# EAGLE design 5vreg (EAGLE 5.11)
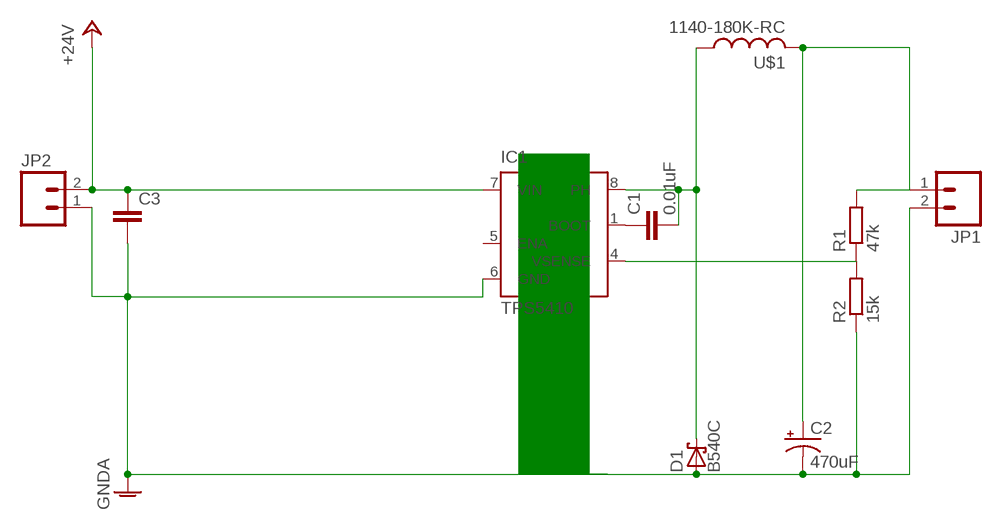
[diagram p0: schematic, sheet 1]

## Parts
C1  0.01uF  C-EU025-030X050  [C025-030X050]
C2  470uF  CAP_POLSMD  [VISHAY_C]
C3  C-EUC1210K  [C1210K]
D1  B540C  MBRS320T3  [SMC]
IC1  TPS5410  [D_R-PDSO-G08]
JP1  M02  [1X02_LONGPADS]
JP2  M02  [1X02_LONGPADS]
R1  47k  R-EU_0309/12  [0309/12]
R2  15k  R-EU_0309/12  [0309/12]
U$1  1140-180K-RC  [1140-180K-RC]

## Nets
+24V: C3.1 IC1.7(VIN) JP2.2
GNDA: C2.- C3.2 D1.A IC1.6(GND) JP1.2 JP2.1 R2.1
N$3: C1.1 IC1.1(BOOT)
PH: C1.2 D1.C IC1.8(PH) U$1.1
VOUT: C2.+ JP1.1 R1.2 U$1.2
VSENSE: IC1.4(VSENSE) R1.1 R2.2
Unconnected: IC1.5(ENA)

## Library data of the parts
C1 C3 = rcl:C-EU: CAPACITOR, European symbol
C2 = SparkFun:CAP_POL: Capacitor Polarized These are standard SMD and PTH capacitors. Normally 10uF, 47uF, and 100uF in electrolytic and tantalum varieties. Always verify the external diameter of the through hole cap, it varies with capacity, voltage, and manufacturer. The EIA devices should be standard.
D1 = diode:MBRS3*0T3: SCHOTTKY BARRIER RECTIFIER 3.0 AMPERES 20, 30, 40 VOLT Source: MBRS340T3-D.pdf
IC1 = texas:TPS5410: 1-A, WIDE INPUT RANGE, STEP-DOWN SWIFT? CONVERTER Source: U7 Texas TPS5410 Step Down Converter.pdf; MPN: TPS5410DR; OC_FARNELL: 1329596; OC_NEWARK: 18M3223
JP1 JP2 = SparkFun:M02: Header 2 Standard 2-pin 0.1" header. Use with straight break away headers (SKU : PRT-00116), right angle break away headers (PRT-00553), swiss pins (PRT-00743), machine pins (PRT-00117), and female headers (PRT-00115). Molex polarized connector foot print use with SKU : PRT-08233 with associated crimp pins and housings.
R1 R2 = rcl:R-EU_: RESISTOR, European symbol
U$1 = mine:1140-180K-RC

## Board
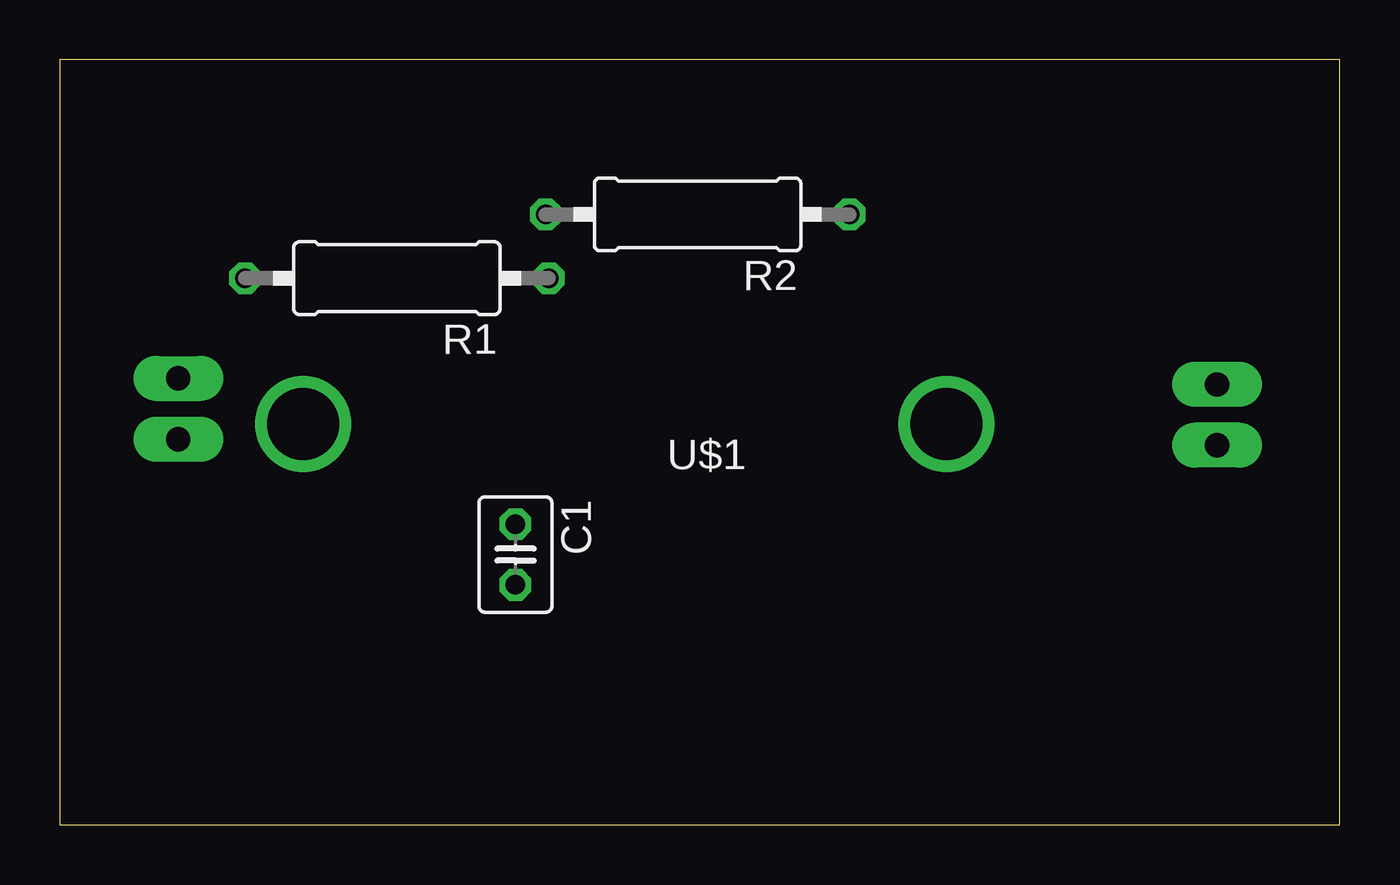
[diagram p1: board, top side]
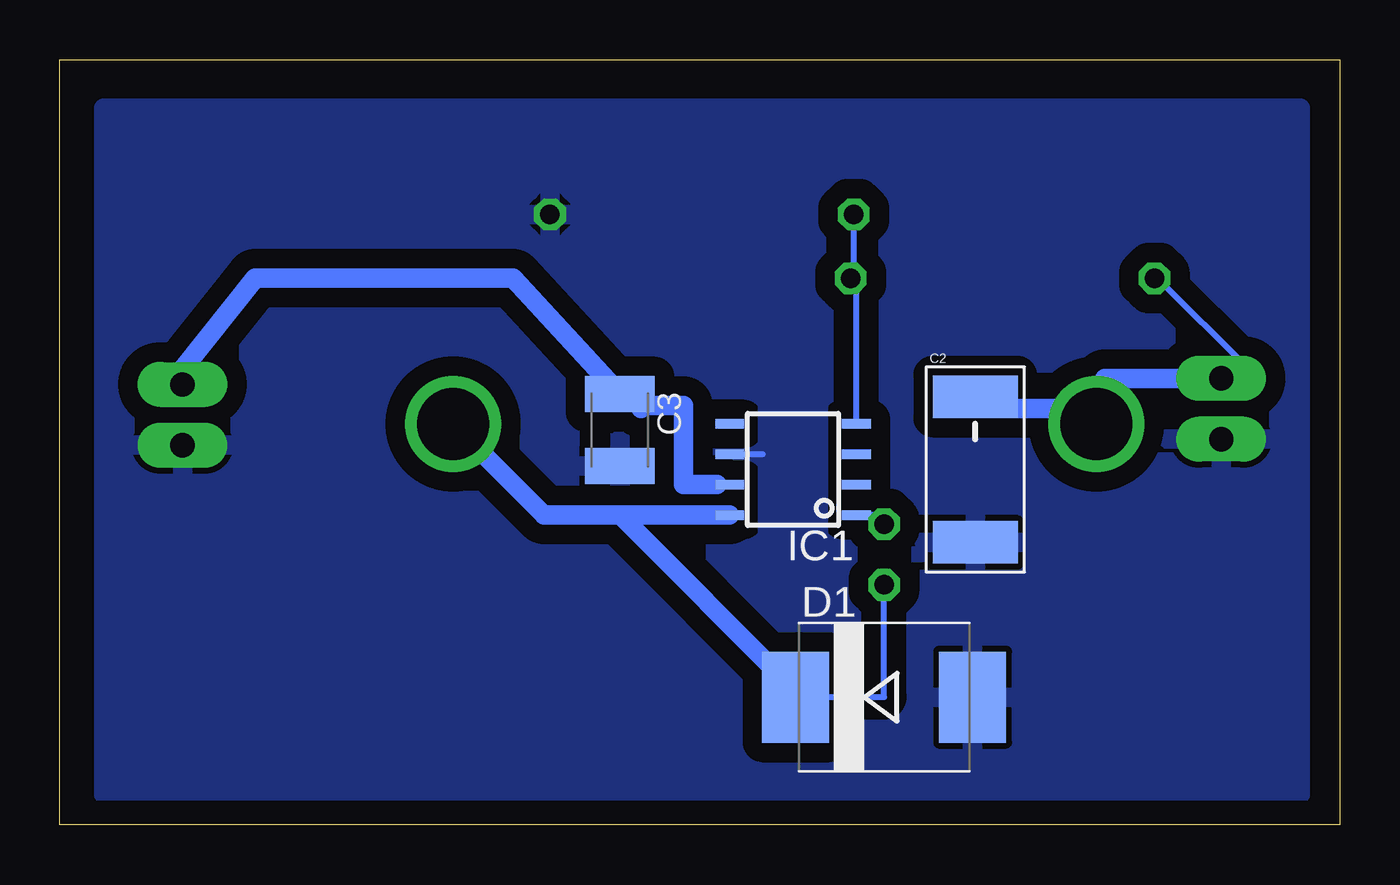
[diagram p2: board, bottom side, seen from below]

Size 53.52 x 31.99 mm. Coordinates in mm from the lower left corner, seen from the top.
Outline: 0,0 53.52,0 53.52,31.99 0,31.99 0,0
Copper layers (1*16): Top 0.035mm / dielectric 1.5mm / Bottom 0.035mm
Design rules "default": minimum track width 10mil, minimum drill 24mil, track to track 8mil, track to pad 8mil, pad to pad 8mil, via to via 8mil, smd to smd 8mil, copper to edge 40mil, drill to drill 8mil, minimum pad ring 10mil, minimum via ring 8mil, stop-mask expansion 4mil, vias tented up to drill 0mil, thermal gap 10mil

### Footprints (pad centres in the part's own frame; a part is rotated, then mirrored left to right if it is on the bottom)
C025-030X050 = drill 0.813 octagon: 1 -1.27,0; 2 1.27,0
VISHAY_C = smd 3.556 x 1.778: + 0,3.048; - 0,-3.048
C1210K = smd 1.5 x 2.9: 1 -1.5,0; 2 1.5,0
SMC = smd 2.8 x 3.8: A 3.7,0; C -3.7,0
D_R-PDSO-G08 = smd 0.4 x 1.2: 1 -1.905,-2.65; 2 -0.635,-2.65; 3 0.635,-2.65; 4 1.905,-2.65; 5 1.905,2.65; 6 0.635,2.65; 7 -0.635,2.65; 8 -1.905,2.65
1X02_LONGPADS = drill 1.016 pad 1.88 long: 1 0,0; 2 2.54,0
0309/12 = drill 0.813 octagon: 1 -6.35,0; 2 6.35,0
1140-180K-RC = drill 3 round: 1 -13.45,0; 2 13.45,0

### Placement (x,y rotation side)
C1  19.05,11.3 270 top
C2  15.24,14.86 0 bottom
C3  30.1,16.51 270 bottom
D1  19.05,5.33 0 bottom
IC1  22.86,14.86 90 bottom
JP1  4.95,18.67 270 top
JP2  48.39,15.88 90 top
R1  14.1,22.86 180 top
R2  26.67,25.53 180 top
U$1  23.62,16.76 180 top

### Tracks (layer width: path | path; a pad name or v marks a point on that pad's centre or on a via)
+24V
  Bottom 0.254: 29.21,17.4 29.84,17.4 C3.1 | IC1.7 26.04,14.22
  Bottom 0.813: JP2.2 48.39,19.05 45.34,22.86 34.57,22.86 C3.1 | 26.04,14.22 27.43,14.22 27.43,17.53 29.21,17.53 29.21,17.4
GNDA
  Bottom 0.254: 24.13,15.49 IC1.6
  pour Bottom (isolate 0.406): 21.59,9.78 21.59,18.67 24.13,18.67 24.13,9.78
  pour Bottom (isolate 0.813): 1.65,29.97 1.65,1.27 51.69,1.27 51.69,29.97
N$3
  Bottom 0.254: IC1.1 19.05,12.95 C1.1
PH
  Bottom 0.254: IC1.8 25.4,12.95 | C1.2 19.05,5.33 D1.C 22.86,5.33
  Bottom 0.813: 30.1,12.95 IC1.8 | 30.1,12.95 33.26,12.95 U$1.1 | 22.86,5.33 22.86,5.71 30.1,12.95
VOUT
  Bottom 0.254: 15.88,18.03 15.88,17.4 15.24,17.4 C2.+ 14.61,17.4 | R1.2 7.62,22.86 3.81,19.05 3.81,18.41 4.45,18.41 JP1.1
  Bottom 0.813: C2.+ 14.73,17.4 | JP1.1 9.53,18.67 | 9.53,18.67 9.81,18.67 | 14.61,17.4 11.43,17.4 11.3,17.53 10.93,17.53 | 10.93,17.53 U$1.2 | 10.93,17.53 10.67,17.53 9.53,18.67
VSENSE
  Bottom 0.254: R2.2 20.32,22.86 R1.1 20.21,22.86 IC1.4
  Bottom 0.406: 20.21,22.86 20.32,22.86